# EAGLE design sensors (EAGLE 7.7.0)
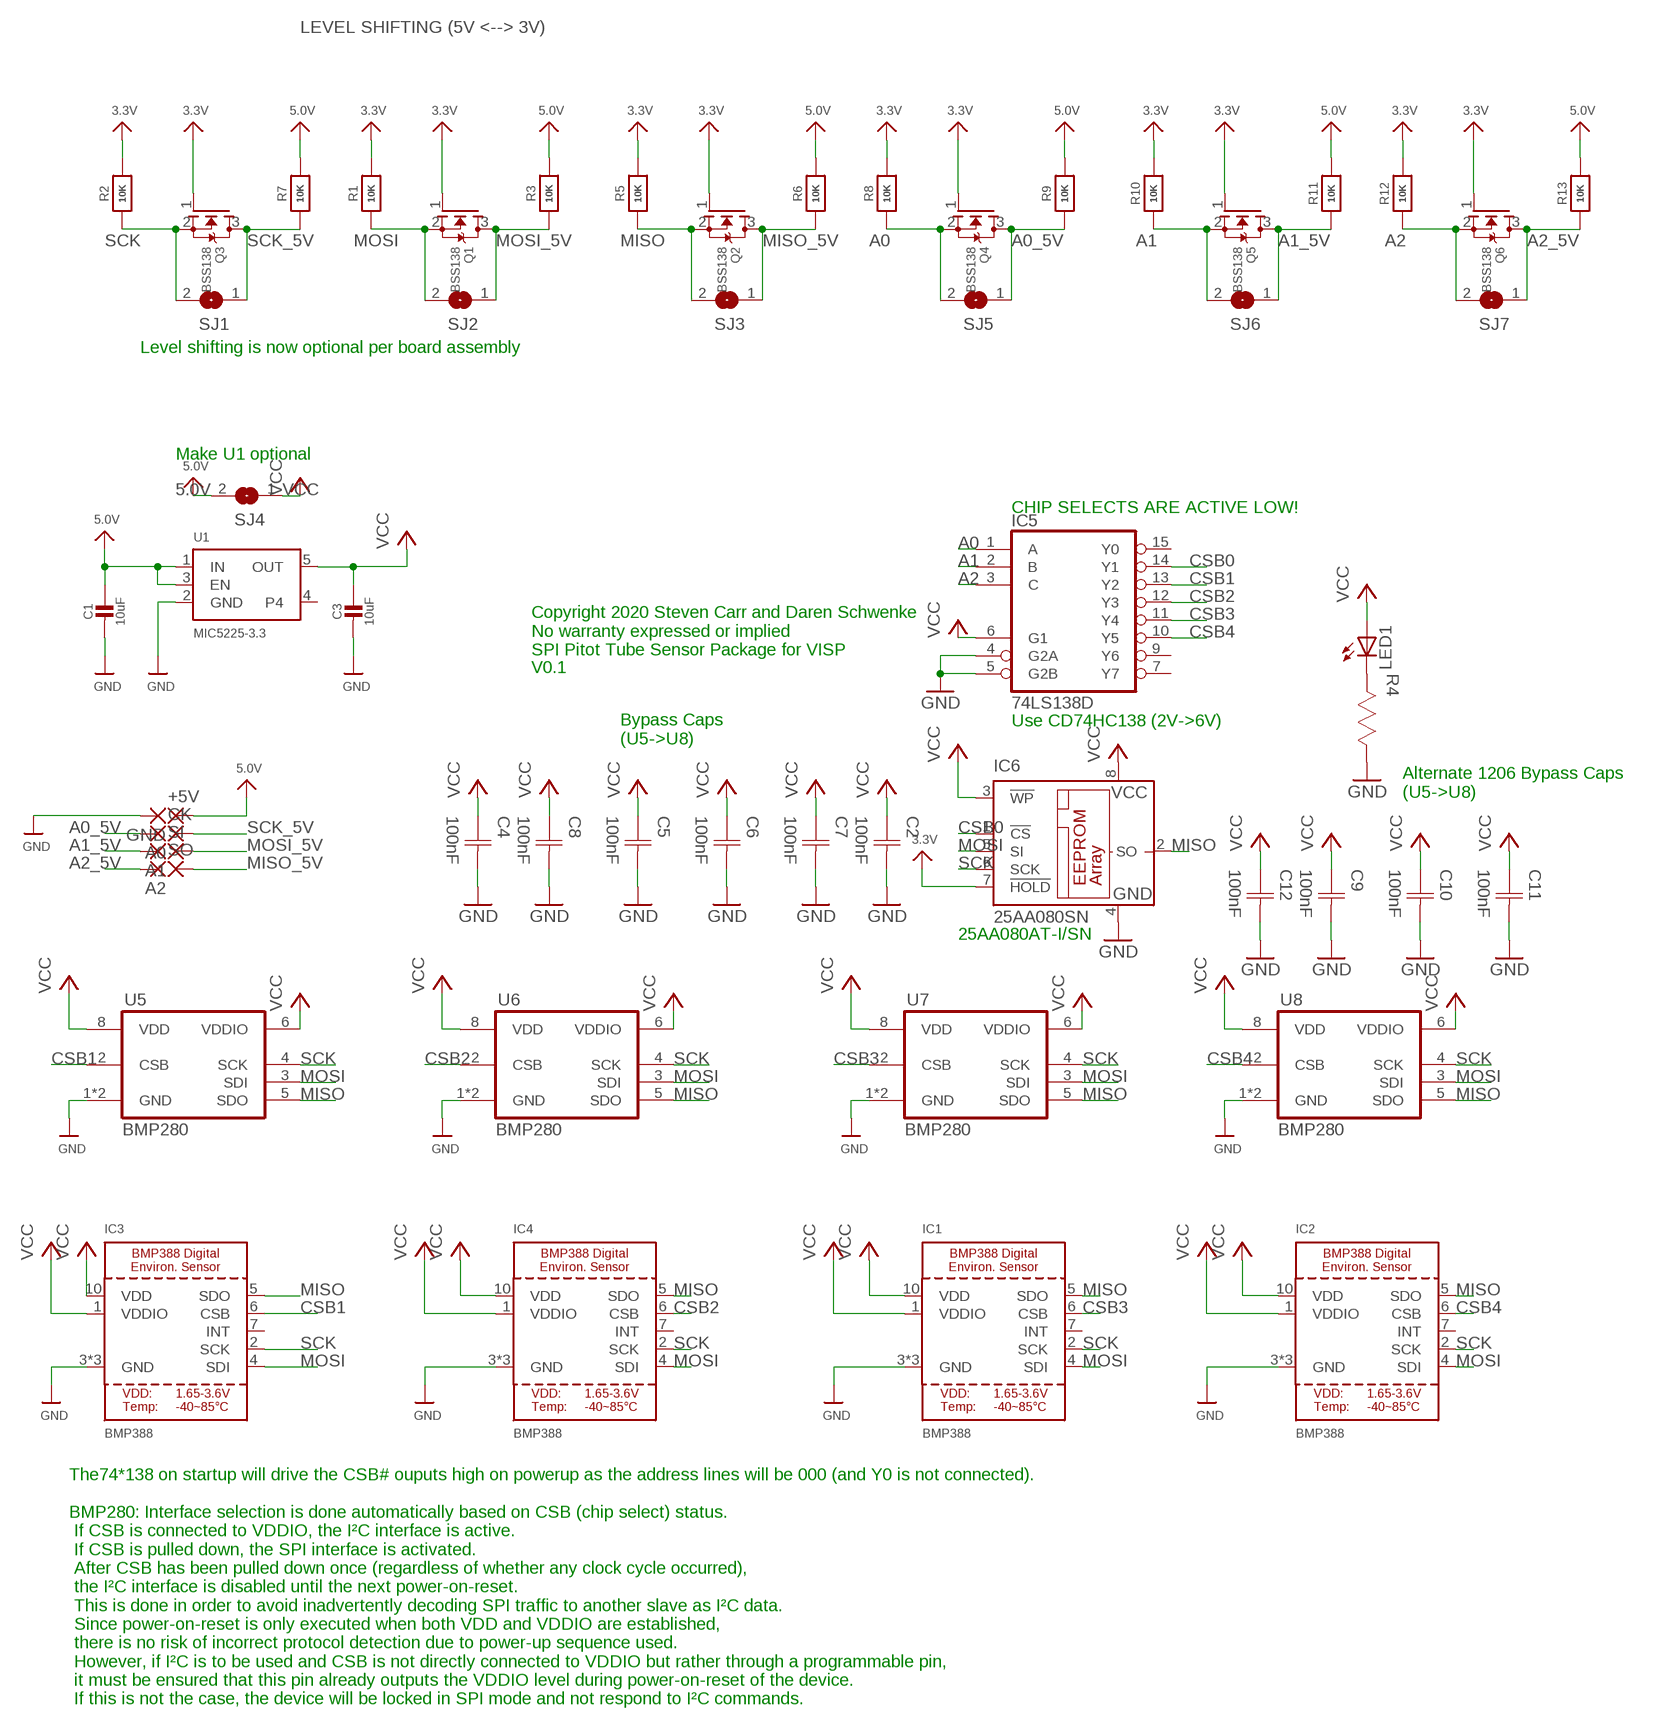
[diagram p0: schematic, sheet 1]

## Parts
+5V  SMD2  [SMD1,27-2,54]
A0  SMD2  [SMD1,27-2,54]
A1  SMD2  [SMD1,27-2,54]
A2  SMD2  [SMD1,27-2,54]
C1  10uF  CAP_CERAMIC0603_NO  [0603-NO]
C2  100nF  CAPACITOR-0402  [CAP0402]
C3  10uF  CAP_CERAMIC0603_NO  [0603-NO]
C4  100nF  CAPACITOR-0402  [CAP0402]
C5  100nF  CAPACITOR-0402  [CAP0402]
C6  100nF  CAPACITOR-0402  [CAP0402]
C7  100nF  CAPACITOR-0402  [CAP0402]
C8  100nF  CAPACITOR-0402  [CAP0402]
C9  100nF  CAPACITOR-1206  [CAP1206]
C10  100nF  CAPACITOR-1206  [CAP1206]
C11  100nF  CAPACITOR-1206  [CAP1206]
C12  100nF  CAPACITOR-1206  [CAP1206]
CK  SMD2  [SMD1,27-2,54]
GND  SMD2  [SMD1,27-2,54]
IC1  BMP388  [BMP388]
IC2  BMP388  [BMP388]
IC3  BMP388  [BMP388]
IC4  BMP388  [BMP388]
IC5  74LS138D  [SO16]
IC6  25AA080SN  [SO-08]
LED1  LEDCHIP-LED0603  [CHIP-LED0603]
Q1  BSS138  MOSFET-NWIDE  [SOT23-WIDE]
Q2  BSS138  MOSFET-NWIDE  [SOT23-WIDE]
Q3  BSS138  MOSFET-NWIDE  [SOT23-WIDE]
Q4  BSS138  MOSFET-NWIDE  [SOT23-WIDE]
Q5  BSS138  MOSFET-NWIDE  [SOT23-WIDE]
Q6  BSS138  MOSFET-NWIDE  [SOT23-WIDE]
R1  10K  RESISTOR0805_NOOUTLINE  [0805-NO]
R2  10K  RESISTOR0805_NOOUTLINE  [0805-NO]
R3  10K  RESISTOR0805_NOOUTLINE  [0805-NO]
R4  RESISTOR-0603  [RES0603]
R5  10K  RESISTOR0805_NOOUTLINE  [0805-NO]
R6  10K  RESISTOR0805_NOOUTLINE  [0805-NO]
R7  10K  RESISTOR0805_NOOUTLINE  [0805-NO]
R8  10K  RESISTOR0805_NOOUTLINE  [0805-NO]
R9  10K  RESISTOR0805_NOOUTLINE  [0805-NO]
R10  10K  RESISTOR0805_NOOUTLINE  [0805-NO]
R11  10K  RESISTOR0805_NOOUTLINE  [0805-NO]
R12  10K  RESISTOR0805_NOOUTLINE  [0805-NO]
R13  10K  RESISTOR0805_NOOUTLINE  [0805-NO]
SI  SMD2  [SMD1,27-2,54]
SJ1  SJ  [SJ]
SJ2  SJ  [SJ]
SJ3  SJ  [SJ]
SJ4  SJ  [SJ]
SJ5  SJ  [SJ]
SJ6  SJ  [SJ]
SJ7  SJ  [SJ]
SO  SMD2  [SMD1,27-2,54]
U1  MIC5225-3.3  VREG_SOT23-5  [SOT23-5]
U5  BMP280  [BMP280]
U6  BMP280  [BMP280]
U7  BMP280  [BMP280]
U8  BMP280  [BMP280]

## Nets
3.3V: IC6.7(!HOLD) Q1.1(G) Q2.1(G) Q3.1(G) Q4.1(G) Q5.1(G) Q6.1(G) R1.2 R2.2 R5.2 R8.2 R10.2 R12.2
5.0V: +5V.1(P) C1.1 R3.2 R6.2 R7.2 R9.2 R11.2 R13.2 SJ4.2 U1.1(IN) U1.3(EN)
A0: IC5.1(A) Q4.2(S) R8.1 SJ5.2
A0_5V: A0.1(P) Q4.3(D) R9.1 SJ5.1
A1: IC5.2(B) Q5.2(S) R10.1 SJ6.2
A1_5V: A1.1(P) Q5.3(D) R11.1 SJ6.1
A2: IC5.3(C) Q6.2(S) R12.1 SJ7.2
A2_5V: A2.1(P) Q6.3(D) R13.1 SJ7.1
CSB0: IC5.14(Y1) IC6.1(!CS)
CSB1: IC3.6(CSB) IC5.13(Y2) U5.2(CSB)
CSB2: IC4.6(CSB) IC5.12(Y3) U6.2(CSB)
CSB3: IC1.6(CSB) IC5.11(Y4) U7.2(CSB)
CSB4: IC2.6(CSB) IC5.10(Y5) U8.2(CSB)
GND: C1.2 C2.2(C2) C3.2 C4.2(C2) C5.2(C2) C6.2(C2) C7.2(C2) C8.2(C2) C9.2(C2) C10.2(C2) C11.2(C2) C12.2(C2) GND.1(P) IC1.3(GND) IC1.8(GND) IC1.9(GND) IC2.3(GND) IC2.8(GND) IC2.9(GND) IC3.3(GND) IC3.8(GND) IC3.9(GND) IC4.3(GND) IC4.8(GND) IC4.9(GND) IC5.4(G2A) IC5.5(G2B) IC6.4(GND) R4.1 U1.2(GND) U5.1(GND) U5.7(GND) U6.1(GND) U6.7(GND) U7.1(GND) U7.7(GND) U8.1(GND) U8.7(GND)
MISO: IC1.5(SDO) IC2.5(SDO) IC3.5(SDO) IC4.5(SDO) IC6.2(SO) Q2.2(S) R5.1 SJ3.2 U5.5(SDO) U6.5(SDO) U7.5(SDO) U8.5(SDO)
MISO_5V: Q2.3(D) R6.1 SJ3.1 SO.1(P)
MOSI: IC1.4(SDI) IC2.4(SDI) IC3.4(SDI) IC4.4(SDI) IC6.5(SI) Q1.2(S) R1.1 SJ2.2 U5.3(SDI) U6.3(SDI) U7.3(SDI) U8.3(SDI)
MOSI_5V: Q1.3(D) R3.1 SI.1(P) SJ2.1
N$1: LED1.C R4.2
SCK: IC1.2(SCK) IC2.2(SCK) IC3.2(SCK) IC4.2(SCK) IC6.6(SCK) Q3.2(S) R2.1 SJ1.2 U5.4(SCK) U6.4(SCK) U7.4(SCK) U8.4(SCK)
SCK_5V: CK.1(P) Q3.3(D) R7.1 SJ1.1
VCC: C2.1(C1) C3.1 C4.1(C1) C5.1(C1) C6.1(C1) C7.1(C1) C8.1(C1) C9.1(C1) C10.1(C1) C11.1(C1) C12.1(C1) IC1.1(VDDIO) IC1.10(VDD) IC2.1(VDDIO) IC2.10(VDD) IC3.1(VDDIO) IC3.10(VDD) IC4.1(VDDIO) IC4.10(VDD) IC5.6(G1) IC6.3(!WP) IC6.8(VCC) LED1.A SJ4.1 U1.5(OUT) U5.6(VDDIO) U5.8(VDD) U6.6(VDDIO) U6.8(VDD) U7.6(VDDIO) U7.8(VDD) U8.6(VDDIO) U8.8(VDD)
Unconnected: IC1.7(INT) IC2.7(INT) IC3.7(INT) IC4.7(INT) IC5.7(Y7) IC5.9(Y6) IC5.15(Y0) U1.4

## Notes on the sheet
- LEVEL SHIFTING (5V <--> 3V)
- Level shifting is now optional per board assembly
- Make U1 optional
- CHIP SELECTS ARE ACTIVE LOW!
- Copyright 2020 Steven Carr and Daren Schwenke
  No warranty expressed or implied
  SPI Pitot Tube Sensor Package for VISP
- V0.1
- Use CD74HC138 (2V->6V)
- Bypass Caps
  (U5->U8)
- Alternate 1206 Bypass Caps
  (U5->U8)
- 25AA080AT-I/SN
- The74*138 on startup will drive the CSB# ouputs high on powerup as the address lines will be 000 (and Y0 is not connected).
  
  BMP280: Interface selection is done automatically based on CSB (chip select) status.
   If CSB is connected to VDDIO, the I²C interface is active.
   If CSB is pulled down, the SPI interface is activated.
   After CSB has been pulled down once (regardless of whether any clock cycle occurred),
   the I²C interface is disabled until the next power-on-reset.
   This is done in order to avoid inadvertently decoding SPI traffic to another slave as I²C data.
   Since power-on-reset is only executed when both VDD and VDDIO are established,
   there is no risk of incorrect protocol detection due to power-up sequence used.
   However, if I²C is to be used and CSB is not directly connected to VDDIO but rather through a programmable pin,
   it must be ensured that this pin already outputs the VDDIO level during power-on-reset of the device.
   If this is not the case, the device will be locked in SPI mode and not respond to I²C commands.

## Power pins joined to a net without a drawn wire
GND: IC5.8(GND)
VCC: IC5.16(VCC)

## Library data of the parts
+5V A0 A1 A2 CK GND SI SO = wirepad:SMD2: SMD PAD
C1 C3 = microbuilder:CAP_CERAMIC: Ceramic Capacitors For new designs, use the packages preceded by an '_' character since they are more reliable: The following footprints should be used on most boards: _0402 - Standard footprint for regular board layouts _0603 - Standard footprint for regular board layouts _0805 - Standard footprint for regular board layouts _1206 - Standard footprint for regular board layouts For extremely tight-pitch boards where space is at a premium, the following 'micro-pitch' footprints can be used (smaller pads, no silkscreen outline, etc.): _0402MP - Micro-pitch footprint for very dense/compact boards _0603MP - Micro-pitch footprint for very dense/compact boards _0805MP - Micro-pitch footprint for very dense/compact boards _1206MP - Micro-pitch footprint for very dense/compact boards
C2 C4-C12 = Capacitor:CAPACITOR
IC1-IC4 = microbuilder:BMP388
IC5 = 74xx-us:74*138: 3-line to 8-line DECODER/DEMULTIPLEXER; MPN: CD74LS138D
IC6 = microchip-3:25*: Serial EEPROM 4 K, SPI bus
LED1 = led:LED: LED OSRAM: - CHIPLED LG R971, LG N971, LY N971, LG Q971, LY Q971, LO R971, LY R971 LH N974, LH R974 LS Q976, LO Q976, LY Q976 LO Q996 - Hyper CHIPLED LW Q18S LB Q993, LB Q99A, LB R99A - SideLED LS A670, LO A670, LY A670, LG A670, LP A670 LB A673, LV A673, LT A673, LW A673 LH A674 LY A675 LS A676, LA A676, LO A676, LY A676, LW A676 LS A679, LY A679, LG A679 - Hyper Micro SIDELED® LS Y876, LA Y876, LO Y876, LY Y876 LT Y87S - SmartLED LW L88C, LW L88S LB L89C, LB L89S, LG L890 LS L89K, LO L89K, LY L89K LS L896, LA L896, LO L896, LY L896 - TOPLED LS T670, LO T670, LY T670, LG T670, LP T670 LSG T670, LSP T670, LSY T670, LOP T670, LYG T670 LG T671, LOG T671, LSG T671 LB T673, LV T673, LT T673, LW T673 LH T674 LS T676, LA T676, LO T676, LY T676, LB T676, LH T676, LSB T676, LW T676 LB T67C, LV T67C, LT T67C, LS T67K, LO T67K, LY T67K, LW E67C LS E67B, LA E67B, LO E67B, LY E67B, LB E67C, LV E67C, LT E67C LW T67C LS T679, LY T679, LG T679 LS T770, LO T770, LY T770, LG T770, LP T770 LB T773, LV T773, LT T773, LW T773 LH T774 LS E675, LA E675, LY E675, LS T675 LS T776, LA T776, LO T776, LY T776, LB T776 LHGB T686 LT T68C, LB T68C - Hyper Mini TOPLED® LB M676 - Mini TOPLED Santana® LG M470 LS M47K, LO M47K, LY M47K Source: http://www.osram.convergy.de LUXEON: - LUMILED® LXK2-PW12-R00, LXK2-PW12-S00, LXK2-PW14-U00, LXK2-PW14-V00 LXK2-PM12-R00, LXK2-PM12-S00, LXK2-PM14-U00 LXK2-PE12-Q00, LXK2-PE12-R00, LXK2-PE12-S00, LXK2-PE14-T00, LXK2-PE14-U00 LXK2-PB12-K00, LXK2-PB12-L00, LXK2-PB12-M00, LXK2-PB14-N00, LXK2-PB14-P00, LXK2-PB14-Q00 LXK2-PR12-L00, LXK2-PR12-M00, LXK2-PR14-Q00, LXK2-PR14-R00 LXK2-PD12-Q00, LXK2-PD12-R00, LXK2-PD12-S00 LXK2-PH12-R00, LXK2-PH12-S00 LXK2-PL12-P00, LXK2-PL12-Q00, LXK2-PL12-R00 Source: www.luxeon.com KINGBRIGHT: KA-3528ASYC Source: www.kingbright.com
Q1-Q6 = microbuilder:MOSFET-N: N-Channel Mosfet LEGEND VDS: Voltage Drain-Source ID: Drain Current RDS(ON): Drain-Source On-State Resistance VGS(TH): Gate-Source Threshold Voltage CISS: Drain-Source Input Capacitance SOT-23 Name VDS ID RDS(ON) VGS(TH) CISS Order Number 2N7002E 60V 260mA 2.5 Ohm 2.5V @ 250uA 26.7pF @ 25V 2N7002ET1GOSTR-ND BSH103 30V 850mA 400 mOhm 400mV @ 1mA 83pF @ 24V BSH103,235-ND BSS138 60V 320mA 1.6 Ohm 1.5V @ 250uA 50pF @ 10V Mouser: 771-BSS138PW115 DMN2075U-7 20V 4.2A 38 mOhm 1V @ 250 uA 594.3pF @ 10V DMN2075U-7DICT-ND * BSS138 good choice for I2C level-shifting POWERPAK 1212-8 Name VDS ID RDS(ON) VGS(TH) CISS Order Number Si7308DN 60V 6A 58 mOhm 3V @ 250uA 665pF @ 15V SI7308DN-T1-E3CT-ND
R1-R3 R5-R13 = microbuilder:RESISTOR: Resistors For new designs, use the packages preceded by an '_' character since they are more reliable: The following footprints should be used on most boards: _0402 - Standard footprint for regular board layouts _0603 - Standard footprint for regular board layouts _0805 - Standard footprint for regular board layouts _1206 - Standard footprint for regular board layouts For extremely tight-pitch boards where space is at a premium, the following 'micro-pitch' footprints can be used (smaller pads, no silkscreen outline, etc.): _0402MP - Micro-pitch footprint for very dense/compact boards _0603MP - Micro-pitch footprint for very dense/compact boards _0805MP - Micro-pitch footprint for very dense/compact boards _1206MP - Micro-pitch footprint for very dense/compact boards
R4 = Resistor:RESISTOR
SJ1-SJ7 = jumper:SJ: SMD solder JUMPER
U1 = microbuilder:VREG_SOT23-5: SOT23-5 Fixed Voltage Regulators Part Current Out V Out V In V Dropout θJA (°C/W) TJ (°C) Digikey Part No. ADP121 150mA 3.3V 3.4-5.5V 0.09V @ 150mA -- -- ADP121-AUJZ33R7CT-ND ADP121 150mA 3.0V 3.1-5.5V 0.09V @ 150mA -- -- ADP121-AUJZ30R7CT-ND ADP122 300mA 3.3V 3.4-5.5V 0.085V @ 300mA -- -- ADP122AUJZ-3.3-R7CT-ND ADP1712 300mA 3.3V 3.5-5.5V 0.17V @ 300mA -- -- ADP1712AUJZ-3.3-R7TR-ND AP7311 (Low Cost) 150mA 3.3V 3.5-6V 0.15V @ 150mA -- -- AP7311-33WG-7DICT-ND LD39015M18R 150mA 1.8V 1.9V-5.5V 0.08V @ 100mA -- -- 497-6977-1-ND LP2985A-33DBVR 150mA 3.3V 3.3-16V 0.28V @ 150mA 206 150 296-18479-1-ND MCP1824T-3302E/OT 300mA 3.3V 3.5V-6V 0.2V @ 300mA -- -- MCP1824T-3302E/OTCT-ND MIC5205-2.5YM5 TR 150mA 2.5V 2.7-16V 0.165V @ 150mA -- -- 576-1257-2-ND MIC5205-3.0YM5 TR 150mA 3.0V 3.2V-16V 0.165V @ 150mA -- -- 576-1258-2-ND MIC5205-3.3YM5 TR 150mA 3.3V 3.5V-16V 0.165V @ 150mA -- -- 576-1259-2-ND TPS780330220 150mA 3.3V+2.2V 3.6-5.5V 250mV Max -- -- 296-23332-1-ND TDA3663/N1,135 100mA 3.3V 3.5-45V 0.18V @ 50mA -- -- 568-5343-1-ND Max operating temp can be calculated using θJA, TJ (max junction temperature), and power in watts. Set the "Maximum Ambient Temperature" until it reaches TJ ("Max Junction Temperature"), which is the absolute limit for safe use of the regulator: Heat Sink Temperature Calculator <http://www.daycounter.com/Calculators/Heat-Sink-Temperature-Calculator.phtml> For example, With 12V source into a 3.3V LP2985 and a 30mA load, we are dissipating (12V-3.3V) * 0.03A = 0.261W. With a θJA of 206 °C/W, a TJ of 150°C, and 261mW we can safely use the chip without a heat sink up to 75°C (=147.1°C Junction Temperature).
U5-U8 = bosch-bmp280:BMP280: The BMP280 is an absolute barometric pressure sensor especially designed for mobile applications. The sensor module is housed in an extremely compact 8-pin metal-lid LGA package with a footprint of only 2.0 × 2.5 mm2 and 0.95 mm package height. Its small dimensions and its low power consumption of 2.7 μA @1Hz allow the implementation in battery driven devices such as mobile phones, GPS modules or watches. The library has been designed by Richard Magdycz <https://www.facebook.com/groups/eaglecadsoftUK>

## Board
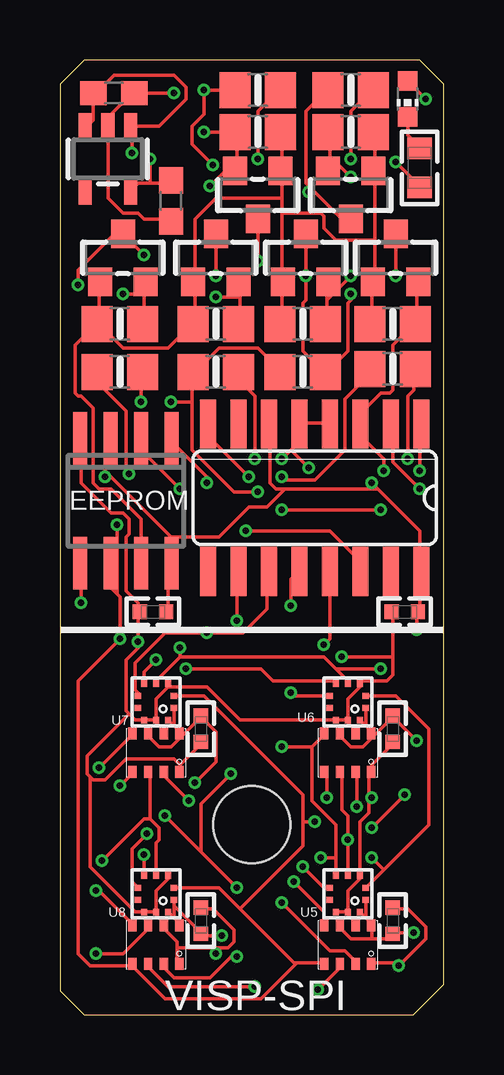
[diagram p1: board, top side]
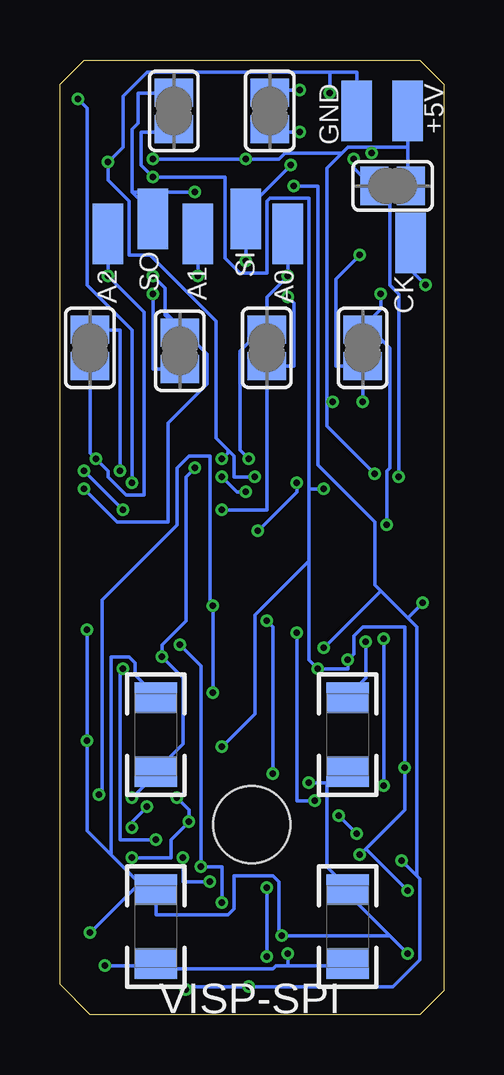
[diagram p2: board, bottom side, seen from below]

Size 16 x 39.8 mm. Coordinates in mm from the lower left corner, seen from the top.
Outline: 1,39.8 0,38.8 0,1 1,0 14.73,0 16,1.27 16,38.8 15,39.8 1,39.8
Copper layers (1*16): Top 0.035559375mm / dielectric 1.6mm / Bottom 0.035559375mm
Design rules "oshpark-2layer": minimum track width 6mil, minimum drill 10mil, track to track 6mil, track to pad 6mil, pad to pad 6mil, via to via 6mil, smd to smd 6mil, copper to edge 15mil, drill to drill 6mil, minimum pad ring 5mil, minimum via ring 5mil, stop-mask expansion 2.5mil, vias tented up to drill 0mil, thermal gap 10mil
Holes 3.2 mm at 8,7.92
vRestrict: area 2.8,2.5 to 5.2,5; area 10.8,10.7 to 13.2,13.2; area 10.8,2.7 to 13.2,5.2; area 2.8,10.7 to 5.2,13.2

### Footprints (pad centres in the part's own frame; a part is rotated, then mirrored left to right if it is on the bottom)
SMD1,27-2,54 = smd 1.27 x 2.54: 1 0,0
0603-NO = smd 1.1 x 1: 1 -0.85,0; 2 0.85,0
CAP0402 = smd 0.6 x 0.6: 1 -0.55,0; 2 0.55,0
CAP1206 = smd 1.27 x 1.778: 1 -1.549,0; 2 1.549,0
BMP388 = smd 0.25 x 0.275: 1 0.25,0.75; 2 -0.25,0.75; 6 -0.25,-0.75; 7 0.25,-0.75 | smd 0.275 x 0.25: 3 -0.762,0.5; 4 -0.762,0; 5 -0.762,-0.5; 8 0.762,-0.5; 9 0.762,0; 10 0.762,0.5
SO16 = smd 0.66 x 2.032: 1 -4.445,-3.073; 2 -3.175,-3.073; 3 -1.905,-3.073; 4 -0.635,-3.073; 5 0.635,-3.073; 6 1.905,-3.073; 7 3.175,-3.073; 8 4.445,-3.073; 9 4.445,3.073; 10 3.175,3.073; 11 1.905,3.073; 12 0.635,3.073; 13 -0.635,3.073; 14 -1.905,3.073; 15 -3.175,3.073; 16 -4.445,3.073
SO-08 = smd 0.6 x 2.2: 1 -1.905,-2.6; 2 -0.635,-2.6; 3 0.635,-2.6; 4 1.905,-2.6; 5 1.905,2.6; 6 0.635,2.6; 7 -0.635,2.6; 8 -1.905,2.6
CHIP-LED0603 = smd 0.8 x 0.8: A 0,-0.75; C 0,0.75
SOT23-WIDE = smd 1 x 1.2: 1 -0.95,-1; 2 0.95,-1; 3 0,1
0805-NO = smd 1.3 x 1.5: 1 -0.95,0; 2 0.95,0
RES0603 = smd 0.889 x 1.016: 1 -0.819,0; 2 0.819,0
SJ = smd 1.168 x 1.6: 1 -0.762,0; 2 0.762,0
SOT23-5 = smd 0.55 x 1.2: 1 -0.95,-1.3; 2 0,-1.3; 3 0.95,-1.3; 4 0.95,1.3; 5 -0.95,1.3
BMP280 = smd 0.35 x 0.5: 1 0.975,-0.8; 2 0.325,-0.8; 3 -0.325,-0.8; 4 -0.975,-0.8; 5 -0.975,0.8; 6 -0.325,0.8; 7 0.325,0.8; 8 0.975,0.8

### Placement (x,y rotation side)
+5V  1.5,37.67 0 bottom
A0  6.5,32.55 0 bottom
A1  10.25,32.55 0 bottom
A2  14,32.55 0 bottom
C1  2.25,38.42 0 top
C2  3.88,16.8 180 top
C3  4.62,33.92 270 top
C4  14.38,16.8 180 top
C5  13.88,3.92 90 top
C6  13.88,11.92 270 top
C7  5.88,11.92 270 top
C8  5.88,3.92 90 top
C9  4,11.67 90 bottom
C10  12,11.67 270 bottom
C11  4,3.67 270 bottom
C12  12,3.67 270 bottom
CK  1.38,32.17 0 bottom
GND  3.62,37.67 0 bottom
IC1  4,13.04 270 top
IC2  4,5.04 270 top
IC3  12,5.04 270 top
IC4  12,13.04 270 top
IC5  10.62,21.55 180 top
IC6  2.75,21.42 180 top
LED1  14.5,38.17 180 top
Q1  8.25,34.17 180 top
Q2  12.12,34.17 180 top
Q3  2.62,31.55 0 top
Q4  6.5,31.55 0 top
Q5  10.25,31.55 0 top
Q6  14,31.55 0 top
R1  8.25,36.8 0 top
R2  2.5,28.8 180 top
R3  8.25,38.55 0 top
R4  15,35.3 90 top
R5  12.12,36.8 0 top
R6  12.12,38.55 0 top
R7  2.5,26.8 180 top
R8  6.5,28.8 180 top
R9  6.5,26.8 180 top
R10  10.12,28.8 180 top
R11  10.12,26.8 180 top
R12  13.88,28.8 180 top
R13  13.88,26.92 180 top
SI  8.25,33.17 0 bottom
SJ1  3.38,27.8 90 bottom
SJ2  7.25,37.67 270 bottom
SJ3  11.25,37.67 270 bottom
SJ4  2.12,34.55 0 bottom
SJ5  7.38,27.8 270 bottom
SJ6  11,27.67 90 bottom
SJ7  14.75,27.8 90 bottom
SO  12.12,33.17 0 bottom
U1  2,35.67 180 top
U5  12,2.92 0 top
U6  12,10.92 0 top
U7  4,10.92 0 top
U8  4,2.92 0 top

### Tracks (layer width: path | path; a pad name or v marks a point on that pad's centre or on a via)
3.3V
  Top 0.152: 13.12,35.17 13.12,36.8 R5.2 | R12.2 13,28.8 13,30.55 Q6.1 13.12,30.55 13.12,32.3 | 13.12,32.3 13.12,35.17 | 13.12,35.17 Q2.1 | 9.25,35.17 9.25,36.8 R1.2 | 9.25,30.55 9.25,28.8 R10.2 | 9.25,30.55 9.25,33.42 | 9.25,33.42 9.25,34.05 | 9.25,34.05 9.25,35.17 | 9.25,35.17 Q1.1 | 9.25,30.55 Q5.1 | 1.62,28.8 1.62,30.55 Q3.1 | 5.62,30.55 5.62,28.8 R8.2 5.5,28.8 4.5,27.8 2.62,27.8 1.62,28.8 | 1.62,28.8 R2.2 1.5,28.8 0.62,27.92 0.62,25.92 0.75,25.8 0.88,25.8 1.38,25.3 1.38,22.17 1.62,21.92 2.12,21.92 3.38,20.67 3.38,18.92 IC6.7 | 9.25,34.05 6.5,34.05 5.62,33.17 5.62,30.55 | 5.62,30.55 Q4.1 | 13.12,32.3 11.5,32.3 11,32.8 11,33.3 10.88,33.42 9.25,33.42
5.0V  (via drill 0.25)
  Top 0.152: R11.2 9.25,26.8 8.25,27.8 6.62,27.8 5.62,26.8 R9.2 5.5,26.8 5.5,25.55 | v9.25,22.42 9.38,22.3 10.62,22.3 11.88,23.55 11.88,25.67 12.88,26.67 12.88,26.92 R13.2 | v8.25,21.8 7.25,21.8 5.5,23.55 5.5,25.55 | U1.3 1.12,37.05 1.38,37.3 1.38,38.42 C1.1 1.5,38.42 2.25,39.17 4.75,39.17 5.25,38.67 5.25,38.17 4.12,37.05 3,37.05 U1.1 3,36.92 v3,35.92 | v2.88,22.55 2.75,22.67 2.75,25.17 1.62,26.3 1.62,26.8 R7.2 | v8.25,35.67 8.25,37.67 9.12,38.55 R3.2 | v12.12,35.67 12.12,37.67 13,38.55 R6.2 | v4.62,25.55 5.5,25.55
  Bottom 0.152: v9.25,22.42 8.62,21.8 v8.25,21.8 | v2.88,22.55 4.88,24.55 4.88,25.55 | 4.88,25.55 4.88,35.3 4.25,35.92 | 4.25,35.92 4,36.17 3,36.17 | 1.5,36.17 3,36.17 | +5V.1 1.5,36.17 | 4.25,35.92 6.62,35.92 6.88,35.67 v8.25,35.67 v12.12,35.67 | 1.5,36.17 1.5,34.67 1.38,34.55 SJ4.2 | 3,36.17 v3,35.92 | 4.88,25.55 v4.62,25.55
A0  (via drill 0.25)
  Top 0.152: 7.5,29.92 7.5,28.8 R8.1 | 7.5,29.92 7.5,30.55 Q4.2 | 7.5,29.92 v6.5,29.92 | v15,22.67 15,24.55 IC5.1 | v9.25,21.05 v13.38,21.05
  Bottom 0.152: v6.5,29.92 6.25,29.67 6.25,27.05 7.38,27.05 SJ5.2 7.38,21.05 v9.25,21.05 | v13.38,21.05 v15,22.67
A0_5V  (via drill 0.25)
  Top 0.152: v6.5,30.8 A0.1 | v8.12,23.17 8.12,25.8 7.5,26.42 7.5,26.8 R9.1
  Bottom 0.152: A0.1 v6.5,30.8 7.38,29.92 SJ5.1 7.38,28.55 7.62,28.55 8.5,27.67 8.5,23.55 v8.12,23.17
A1  (via drill 0.25)
  Top 0.152: 11.12,29.8 11.12,28.8 R10.1 | 11.12,29.8 11.12,30.55 Q5.2 | 11.12,29.8 v12.12,30.8 | v15,21.92 13.88,23.05 13.88,24.55 IC5.2
  Bottom 0.152: 11.62,29.3 11.62,30.3 v12.12,30.8 | 11.62,29.3 11.62,29.17 11,28.55 SJ6.2 | v15,21.92 13.62,20.55 11.5,20.55 11.5,24.67 9.88,26.3 9.88,27.55 11.62,29.3
A1_5V  (via drill 0.25)
  Top 0.152: A1.1 v10.25,30.8 10.25,29.8 10.12,29.67 10.12,27.67 11,26.8 R11.1 11.12,26.8 12,27.67 12,29.67 12.12,29.8 v12.12,30.05
  Bottom 0.152: v12.12,30.05 12.12,26.92 SJ6.1 | v10.25,30.8 A1.1
A2  (via drill 0.25)
  Top 0.152: Q6.2 14.88,30.55 14.88,28.8 R12.1 14.75,28.8 13.88,27.92 13.88,26.05 13.75,25.92 13.38,25.92 12.62,25.17 12.62,24.67 IC5.3 12.62,24.55 12.62,24.05 13.5,23.17 v13.5,22.67
  Bottom 0.152: v13.5,22.67 13.5,28.55 14.75,28.55 SJ7.2
A2_5V  (via drill 0.25)
  Top 0.152: v14.5,23.17 14.5,25.8 14.75,26.05 14.75,26.92 R13.1 | v14,30.8 A2.1
  Bottom 0.152: SJ7.1 14.75,23.42 v14.5,23.17 14,22.67 14,22.42 13.25,21.67 12.5,21.67 12.5,29.3 v14,30.8 A2.1
CSB0  (via drill 0.25)
  Top 0.152: v7.75,20.17 11.25,20.17 12.5,18.92 12.5,18.55 IC5.14 | v6.12,22.17 6.12,22.42 4.62,23.92 IC6.1
  Bottom 0.152: v7.75,20.17 6.12,21.8 v6.12,22.17
CSB1  (via drill 0.25)
  Top 0.152: IC3.6 11,5.29 v10.12,6.17 | v9.25,4.67 11.25,2.67 11.88,2.67 12.38,2.17 U5.2 | v11,15.42 11.25,15.67 11.25,18.42 IC5.13
  Bottom 0.152: v9.25,4.67 9.25,6.17 v10.12,6.17 10.12,14.54 v11,15.42
CSB2  (via drill 0.25)
  Top 0.152: IC4.6 9.75,13.29 v9.62,13.42 | v9.62,17.05 9.62,18.17 9.88,18.42 IC5.12 | v12.38,8.67 12.38,10.04 U6.2 | v14.38,9.17 v13,7.79
  Bottom 0.152: v9.62,13.42 v9.62,17.05 9.75,17.17 9.75,23.3 10.62,23.3 11.12,22.8 11.12,20.42 14.25,17.3 14.25,9.29 v14.38,9.17 | v12.38,8.67 13,8.04 v13,7.79
CSB3  (via drill 0.25)
  Top 0.152: IC1.6 3.25,13.42 3.12,13.54 3.12,14.67 4.38,15.92 v6.12,15.92 7.62,15.92 8.62,16.92 8.62,18.42 IC5.11 | v5.38,8.92 4.38,9.92 4.38,10.04 U7.2
  Bottom 0.152: v5.38,8.92 6.12,8.92 v6.12,15.92
CSB4  (via drill 0.25)
  Top 0.152: IC2.6 3,5.54 3,6.92 v3.62,7.54 | v7.38,5.29 5.88,6.79 | 5.88,6.79 v4.38,8.29 | v7.38,2.42 7.12,2.42 6.25,1.54 4.75,1.54 4.25,2.04 U8.2 | v7.38,16.42 7.38,18.42 IC5.10 | v7.12,10.04 5.88,8.79 5.88,6.79
  Bottom 0.152: v4.38,8.29 v3.62,7.54 | v7.38,2.42 v7.38,5.29 | v7.38,16.42 7.12,16.17 v7.12,10.04
GND  (via drill 0.25)
  Top 0.152: C3.2 4.62,33.17 3.5,33.17 3.25,33.42 2.62,33.42 2,34.05 U1.2 2,37.42 3,38.42 C1.2 v4.75,38.42 | IC5.4 11.25,24.67 10,24.67 IC5.5 9.88,24.55 9.88,23.8 9.62,23.55 | v14,35.55 15,34.55 R4.1 | v7.88,22.42 6.25,24.05 6.25,24.55 IC5.8 | v9.25,23.17 9.62,23.55 | 14.12,2.17 14.25,2.17 15.25,3.17 15.25,3.67 14.5,4.42 13.88,4.42 C5.2 | 14.12,2.17 13,2.17 U5.1 | v14.12,2.04 14.12,2.17 | C6.2 13.88,11.29 13,10.42 13,10.17 U6.1 12.88,10.04 12.88,9.04 | 12,4.29 11.5,4.29 IC3.8 | 12,4.29 12,5.17 12.5,5.67 IC3.3 12.5,8.04 12.88,8.42 12.88,9.04 | 12,4.29 IC3.9 12,4.17 12.25,3.92 12.25,3.79 U5.7 | 12.88,9.04 v13,9.04 | 12,12.29 11.5,12.29 | 12,12.29 12,13.17 12.5,13.67 IC4.3 12.5,13.92 13.62,13.92 13.88,14.17 13.88,14.92 | 12,12.29 IC4.9 12,12.17 12.25,11.92 12.25,11.79 U6.7 | 13.88,14.92 13.88,16.8 C4.2 | 4,4.29 3.5,4.29 | IC2.3 4.5,5.67 4,5.17 4,4.29 | 4,4.29 IC2.9 4,4.17 4.25,3.92 4.25,3.79 U8.7 4.25,3.67 4.88,3.04 4.88,2.79 | 4.88,2.79 4.88,2.17 U8.1 | 4.88,2.79 6.5,2.79 | 6.5,2.79 7,2.79 7.25,3.04 7.25,3.54 6.38,4.42 5.88,4.42 C8.2 | 5,10.42 5,10.17 U7.1 | 5,10.42 5.88,11.29 C7.2 | 4,12.29 3.5,12.29 | 4.5,13.67 IC1.3 | 4.5,13.67 4,13.17 4,12.29 | 4,12.29 IC1.9 4,12.17 4.25,11.92 4.25,11.79 U7.7 | 3.25,16.8 v3.25,15.54 3.25,15.29 2.75,14.79 2.75,12.67 2.88,12.54 | 2.88,12.54 3.12,12.29 3.5,12.29 | 3.5,12.29 IC1.8 | 5,10.42 4.75,10.67 2.75,10.67 1.88,9.79 1.38,9.79 1.25,9.92 | 1.25,9.92 1.12,10.04 1.12,10.79 2.88,12.54 | 3.25,16.8 3.25,17.17 2.75,17.67 2.75,19.92 2.88,20.05 2.88,20.67 2.62,20.92 2.12,20.92 0.88,22.17 0.88,23.92 IC6.4 | 3.25,16.8 C2.2 | 3.5,4.29 3.12,4.29 1.25,6.17 1.25,9.92 | 3.5,4.29 IC2.8
  Top 0.152: 11.5,12.29 7.5,12.29 6.12,13.67 4.5,13.67 | 11.5,12.29 IC4.8 | 13.88,14.92 v11.75,14.92 | 6.5,2.79 v6.5,2.54 | v10.38,22.8 9.62,23.55
  Bottom 0.152: 4.75,39.3 3.62,39.3 GND.1 | 4.75,39.3 12.38,39.3 13.38,38.3 13.38,36.17 v14,35.55 14,34.8 13.12,33.92 13.12,31.67 12.25,31.67 9.5,28.92 9.5,24.05 9,23.55 | v7.88,22.42 8.75,22.42 8.75,23.3 9,23.55 | v9.25,23.17 9,23.42 9,23.55 | 4.75,39.3 v4.75,38.42 | 6.5,2.04 7,2.04 7.12,1.92 12,1.92 12,2.04 | 6.5,2.04 4,2.04 C11.2 | 12,2.04 v14.12,2.04 | 12,2.04 C12.2 | v13,9.04 12,10.04 C10.2 12,10.17 10.88,11.29 10.88,14.04 v11.75,14.92 11.75,15.42 10.75,16.42 10.75,22.42 v10.38,22.8 | v3.25,15.54 3.25,14.04 4,13.29 C9.2 | v6.5,2.54 6.5,2.04
MISO  (via drill 0.25)
  Top 0.152: 11.5,6.54 11.5,7.92 10.5,8.92 10.5,11.17 | 11.5,6.54 IC3.5 | 10.5,11.17 11,11.67 U6.5 | v9.75,5.54 11,4.29 11,3.79 U5.5 | 11.5,6.54 v10.88,6.54 | 11.25,35.8 11.25,36.8 R5.1 | 11.25,35.8 11.25,35.17 Q2.2 | 11.25,35.8 v12.12,34.92 | v3.5,6.67 IC2.5 | v1.62,10.29 3,11.67 U7.5 | IC1.5 3.5,14.29 v4,14.79 | v5.25,14.42 8.38,14.42 8.88,13.92 11.5,13.92 IC4.5 | v1.5,5.17 1.62,5.17 3,3.79 U8.5 | v5,21.92 3.5,23.42 3.5,23.92 IC6.2 | v9.25,11.17 10.5,11.17
  Bottom 0.152: v9.75,5.54 10.88,5.54 v10.88,6.54 | SJ3.2 11.25,36.8 12.62,36.8 12.62,35.42 v12.12,34.92 9.12,34.92 9.12,31.55 8.5,30.92 7.38,30.92 7.38,33.92 7.25,34.05 5.62,34.05 5.62,21.92 | 3.25,6.92 1.62,8.54 v1.62,10.29 1.62,16.17 3.38,16.17 3.75,15.79 3.75,15.04 v4,14.79 4,14.42 v5.25,14.42 5.62,14.79 5.62,18.92 | 3.25,6.92 v3.5,6.67 | 3.25,6.92 v1.5,5.17 | 5.62,18.92 5.62,21.92 | 5.62,21.92 v5,21.92 | v9.25,11.17 7.88,12.54 7.88,16.67 5.62,18.92
MISO_5V  (via drill 0.25)
  Top 0.152: SO.1 11.75,33.17 10.5,34.42 | 10.5,34.42 10.25,34.67 10.25,37.67 11.12,38.55 R6.1 | v10.38,34.3 10.5,34.42
  Bottom 0.152: 13,34.3 13,36.92 12.75,37.17 12.75,38.42 SJ3.1 | 13,34.3 12.12,33.42 SO.1 | 13,34.3 v10.38,34.3
MOSI  (via drill 0.25)
  Top 0.152: IC3.4 v12,7.29 12,8.29 11.75,8.54 11.75,10.04 U6.3 | 5,14.92 4,13.92 IC1.4 | 5,14.92 11,14.92 11.5,14.42 | 11.5,14.42 12,13.92 IC4.4 | 11.5,14.42 v13.38,14.42 | v6,36.8 R1.1 7.38,36.8 7.38,35.17 Q1.2 6.88,35.17 v6.25,34.55 | IC2.4 4,7.17 4.12,7.29 4.12,7.79 3.75,8.17 | 3.75,8.17 3.75,10.04 U7.3 | v8.12,1.17 4.5,1.17 3.75,1.92 3.75,2.04 U8.3 | v10.75,1.04 11.75,2.04 U5.3 | 3.75,8.17 3.5,8.17 v1.75,6.42 | v0.88,17.17 0.88,18.8 IC6.5 | v5,15.29 5,14.92
  Bottom 0.152: v12,7.29 13.5,7.29 13.5,14.29 v13.38,14.42 | v6,36.8 7.25,36.8 SJ2.2 | v10.75,1.04 10.75,1.17 v8.12,1.17 2.12,1.17 1,2.29 1,5.67 1.12,5.79 | 1.12,5.79 v1.75,6.42 | v6.25,34.55 5.25,34.55 5.25,22.92 2.88,20.55 2.88,17.92 2.62,17.67 | 1.5,16.55 1.12,16.17 1.12,5.79 | 1.5,16.55 2.62,17.67 | 1.5,16.55 v0.88,17.17 | 2.62,17.67 v5,15.29
MOSI_5V  (via drill 0.25)
  Top 0.152: R3.1 v6,38.55 6,37.55 5.5,37.05 5.5,36.3 v6.38,35.42 | v8.25,31.42 SI.1
  Bottom 0.152: v6,38.55 7.25,38.55 SJ2.1 | v8.25,31.42 SI.1 8.25,33.55 v6.38,35.42
N$1
  Top 0.152: LED1.C 14.5,36.67 15,36.17 R4.2
SCK  (via drill 0.25)
  Top 0.152: 13.5,6.04 15.38,7.92 15.38,11.92 14,13.29 IC4.2 | 13.5,6.04 IC3.2 | IC2.2 6.62,5.29 7.5,4.42 | 7.5,4.42 9.75,2.17 9.88,2.17 | 9.88,2.17 11,2.17 U5.4 | IC1.2 6,13.29 10.12,9.17 10.12,8.04 | 10.12,8.04 10.12,7.04 7.5,4.42 | 9.88,2.17 8.38,0.67 4.38,0.67 3.12,1.92 3.12,2.04 U8.4 3,2.04 1.25,2.04 0.75,2.54 0.75,13.92 v2.5,15.67 2.5,17.42 2.38,17.55 | v11.12,9.04 11.12,10.04 U6.4 | 10.12,8.04 v10.62,8.04 | v13,6.54 13.5,6.04 | 3.5,30.05 3.5,28.8 R2.1 | 3.5,30.05 3.5,30.55 Q3.2 3.5,30.05 | 3.5,30.05 v2.62,30.05 | v2.5,9.54 3,10.04 U7.4 | 2.38,17.55 2.12,17.8 2.12,18.8 IC6.6 | 2.38,17.55 v2.38,20.42
  Bottom 0.152: v11.12,9.04 10.62,8.54 v10.62,8.04 11.38,7.29 11.38,6.54 v13,6.54 | 3.25,28.8 2.62,29.42 v2.62,30.05 | 3.25,28.8 3.38,28.67 SJ1.2 3.25,28.8 | v2.5,15.67 v2.5,9.54 | 3.25,28.8 2.25,27.8 2.25,22.8 2.38,22.67 v2.38,20.42
SCK_5V  (via drill 0.25)
  Top 0.152: v3.38,25.55 3.38,26.8 R7.1 | v0.75,30.42 0.75,31.05 2.25,32.55 Q3.3 v3.5,31.67
  Bottom 0.152: v3.38,25.55 SJ1.1 3.38,27.05 4.5,27.05 4.5,30.67 v3.5,31.67 | v0.75,30.42 1.38,31.05 CK.1
VCC  (via drill 0.25)
  Top 0.152: 4.75,12.04 5,11.79 U7.8 5,11.67 5.12,11.67 | 4.75,12.04 4.5,12.29 IC1.10 | 4.75,12.04 IC1.1 | 5.88,12.42 5.12,11.67 | 5.12,11.67 4.62,11.17 4.12,11.17 3.75,11.54 3.75,11.67 U7.6 | 5.88,12.42 6.5,11.79 6.5,10.54 v5.62,9.67 | 5.88,12.42 C7.1 | 4.75,4.04 5,3.79 U8.8 | 4.75,4.04 4.5,4.29 IC2.10 | 4.75,4.04 4.75,4.54 | 4.75,4.54 IC2.1 | 4.75,4.54 5.88,3.42 C8.1 5.88,3.29 v6.75,3.29 | v1.5,2.54 2.62,2.54 3.62,3.54 3.62,3.67 U8.6 | 12.75,4.04 13,3.79 U5.8 13,3.67 13,3.17 | 12.75,4.04 12.5,4.29 IC3.10 | 12.75,4.04 IC3.1 | 13,3.17 13.75,3.17 13.88,3.29 C5.1 13.88,3.42 v14.75,3.42 | 13,3.17 12.12,3.17 11.75,3.54 11.75,3.67 U5.6 | 12.75,12.04 13,11.79 U6.8 13,11.67 13.12,11.67 | 12.75,12.04 12.5,12.29 IC4.10 | 12.75,12.04 IC4.1 | 13.88,12.42 13.12,11.67 | 13.12,11.67 12.62,11.17 12.12,11.17 11.75,11.54 11.75,11.67 U6.6 | v14.88,11.42 13.88,12.42 | 13.88,12.42 C6.1 | C2.1 4.5,16.8 4.5,18.67 4.62,18.8 IC6.8 4.62,18.92 4.62,19.92 | 3.75,34.67 3.25,34.67 3,34.42 U1.5 | 3.75,34.67 4.62,34.67 C3.1 | 3.75,34.67 v3.75,35.67 | 1.88,22.67 1.88,23.8 2,23.92 IC6.3 | 1.88,22.67 4.62,19.92 | 1.88,22.67 v1.88,22.42 | v15.25,38.17 LED1.A | 13.25,21.92 15,20.17 15,18.55 IC5.16 15,18.42 15,16.8 C4.1 14.88,16.8 v14.88,16.05 | 13.25,21.92 v13,22.17 | 13.25,21.92 9.38,21.92 | 9.38,21.92 9,21.92 8.75,22.17 8.75,24.55 IC5.6 | 4.62,19.92 6.62,19.92 7.88,21.17 8.62,21.17 9.38,21.92
  Bottom 0.152: 4.88,9.67 4,9.67 C9.1 4.88,9.67 | 4.88,9.67 v5.62,9.67 | 2.25,3.29 4,5.04 C11.1 4,5.29 4.88,6.17 4.88,9.67 | 2.25,3.29 v1.5,2.54 | 2.25,3.29 v6.75,3.29 6.88,3.42 6.88,5.54 7.12,5.79 8.75,5.79 8.75,4.42 9,4.17 12,4.17 C12.1 | 12.75,5.54 12.5,5.29 12,5.29 C12.1 | 12.75,5.54 13.88,6.67 | 13.88,6.67 14.88,7.67 v14.88,11.42 v14.88,16.05 | v14.75,3.42 12.75,5.42 12.75,5.54 | 12.75,5.54 C12.1 | 13.88,6.67 13.88,14.92 13.12,14.92 12.88,14.67 12.88,14.17 12,13.29 C10.1 | v3.75,35.67 3.75,35.3 3,34.55 SJ4.1 2.88,34.55 2.25,33.92 2.25,30.42 1.88,30.05 v1.88,22.42 | v15.25,38.17 14.88,37.8 14.88,30.42 13,28.55 v13,22.17

### Text on the board
tNames: EEPROM | VISP-SPI
bNames: VISP-SPI
tValues: (c) 2020 Steven Carr / & Daren Schwenke
bValues: (c) 2020 Steven Carr / & Daren Schwenke